# Altium schematic sheet one_channel.SchDoc
size A3; SheetNumber: 2; SheetTotal: 2
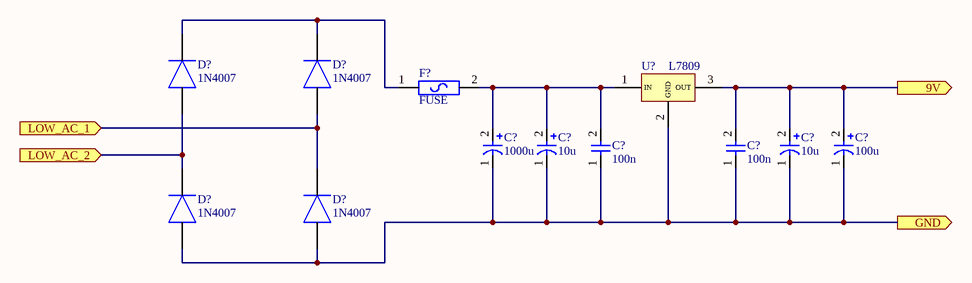
[diagram p0: one_channel.SchDoc]

## Parts
(Parts that share a designator on the sheet are numbered #1, #2 ... from top to bottom, then left to right.)
C?#1  1000u
C?#2  10u
C?#3  100n  [FP-1206-L_3_2_0_2-W_1_6_0-IPC_B]
C?#4  100n  [FP-1206-L_3_2_0_2-W_1_6_0-IPC_B]
C?#5  10u
C?#6  100u
D?#1  1N4007  [DIODE_THT]
D?#2  1N4007  [DIODE_THT]
D?#3  1N4007  [DIODE_THT]
D?#4  1N4007  [DIODE_THT]
F?  FUSE  [FUSE_SOCKET_5x20mm]
U?  L7809  [TO-220]

## Ports
9V (out, see psu[3B]), GND (out, see psu[3B]), LOW_AC_1 (in, see psu[2B]), LOW_AC_2 (in, see psu[2B])

## Nets
9V: C?#4.2 C?#5.2 C?#6.2 U?.3(OUT) ; port 9V
GND: C?#1.1 C?#2.1 C?#3.1 C?#4.1 C?#5.1 C?#6.1 D?#3.1(A) D?#4.1(A) U?.2(GND) ; port GND
LOW_AC_1: D?#2.1(A) D?#4.2(K) ; port LOW_AC_1
LOW_AC_2: D?#1.1(A) D?#3.2(K) ; port LOW_AC_2
NetC?#1_2: C?#1.2 C?#2.2 C?#3.2 F?.2 U?.1(IN)
NetD?#1_2: D?#1.2(K) D?#2.2(K) F?.1

## Library data of the parts
C?#1 C?#2 C?#5 C?#6 = cap_pol
C?#3 C?#4 = cap_unpol
D?#1-D?#4 = 1N4148